# Altium schematic sheet Power Management.SchDoc
size A4; SheetNumber: 4; SheetTotal: 4
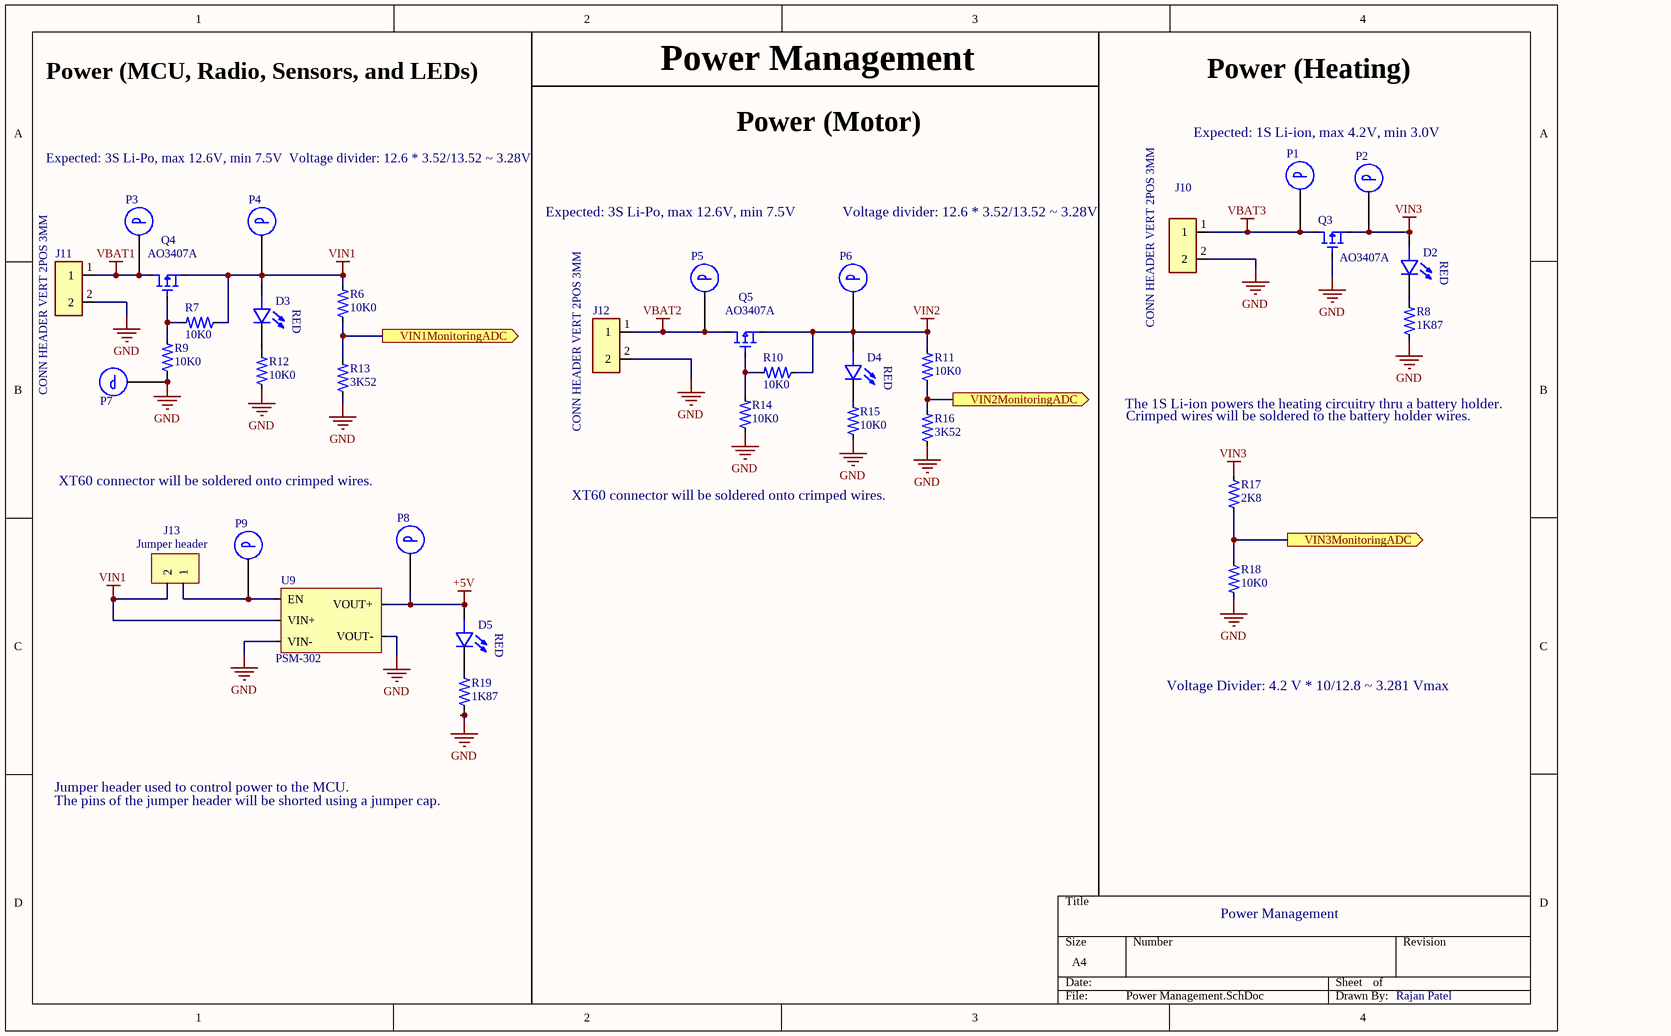
[diagram p0: Power Management.SchDoc]

## Parts
D2  LED 0805  [LED_0805]  (value not drawn)
D3  LED 0805  [LED_0805]  (value not drawn)
D4  LED 0805  [LED_0805]  (value not drawn)
D5  LED 0805  [LED_0805]  (value not drawn)
J10  CONN HEADER VERT 2POS 3MM  [CONN HEADER VERT 2POS 3MM]
J11  CONN HEADER VERT 2POS 3MM  [CONN HEADER VERT 2POS 3MM]
J12  CONN HEADER VERT 2POS 3MM  [CONN HEADER VERT 2POS 3MM]
J13  Jumper header  [2 Pin Male Header]
P1  Probe_5019  [Testpoint]  (value not drawn)
P2  Probe_5019  [Testpoint]  (value not drawn)
P3  Probe_5019  [Testpoint]  (value not drawn)
P4  Probe_5019  [Testpoint]  (value not drawn)
P5  Probe_5019  [Testpoint]  (value not drawn)
P6  Probe_5019  [Testpoint]  (value not drawn)
P7  Probe_5019  [Testpoint]  (value not drawn)
P8  Probe_5019  [Testpoint]  (value not drawn)
P9  Probe_5019  [Testpoint]  (value not drawn)
Q3  AO3407A  [AO3407A]
Q4  AO3407A  [AO3407A]
Q5  AO3407A  [AO3407A]
R6  10K0  [res 0805]
R7  10K0  [res 0805]
R8  1K87  [res 0805]
R9  10K0  [res 0805]
R10  10K0  [res 0805]
R11  10K0  [res 0805]
R12  10K0  [res 0805]
R13  3K52  [res 0805]
R14  10K0  [res 0805]
R15  10K0  [res 0805]
R16  3K52  [res 0805]
R17  2K8  [res 0805]
R18  10K0  [res 0805]
R19  1K87  [res 0805]
U9  PSM-302  [PSM-302]

## Ports
VIN1MonitoringADC (out, see MCU, Radios, and Sensors[3C]), VIN2MonitoringADC (out, see MCU, Radios, and Sensors[4C]), VIN3MonitoringADC (out, see MCU, Radios, and Sensors[3C])

## Nets
+5V: D5.2(A) P8.1 U9.5(VOUT+)
GND: J10.2 J11.2 J12.2 P7.1 Q3.1(Gate) R8.1 R9.1 R12.1 R13.1 R14.1 R15.1 R16.1 R18.2 R19.1 U9.3(VIN-) U9.4(VOUT-)
VBAT1: J11.1 P3.1 Q4.3(Drain)
VBAT2: J12.1 P5.1 Q5.3(Drain)
VBAT3: J10.1 P1.1 Q3.3(Drain)
VIN1: D3.2(A) J13.2 P4.1 Q4.2(Source) R6.2 R7.1 U9.2(VIN+)
VIN2: D4.2(A) P6.1 Q5.2(Source) R10.1 R11.2
VIN3: D2.2(A) P2.1 Q3.2(Source) R17.1
VIN1MonitoringADC: R6.1 R13.2 ; port VIN1MonitoringADC
VIN2MonitoringADC: R11.1 R16.2 ; port VIN2MonitoringADC
VIN3MonitoringADC: R17.2 R18.1 ; port VIN3MonitoringADC
NetD2_1: D2.1(C) R8.2
NetD3_1: D3.1(C) R12.2
NetD4_1: D4.1(C) R15.2
NetD5_1: D5.1(C) R19.2
NetJ13_1: J13.1 P9.1 U9.1(EN)
NetQ4_1: Q4.1(Gate) R7.2 R9.2
NetQ5_1: Q5.1(Gate) R10.2 R14.2

## Notes on the sheet
- Power (MCU, Radio, Sensors, and LEDs)
- Power Management
- Power (Heating)
- Expected: 3S Li-Po, max 12.6V, min 7.5V
- Voltage divider: 12.6 * 3.52/13.52 ~ 3.28V
- Power (Motor)
- Expected: 1S Li-ion, max 4.2V, min 3.0V
- The 1S Li-ion powers the heating circuitry thru a battery holder.
- Crimped wires will be soldered to the battery holder wires.
- XT60 connector will be soldered onto crimped wires.
- Voltage Divider: 4.2 V * 10/12.8 ~ 3.281 Vmax
- Jumper header used to control power to the MCU.
- The pins of the jumper header will be shorted using a jumper cap.
- Rajan Patel
- (in symbol LED 0805) RED

## Library data of the parts
D2-D5 = LED 0805: Red LED Indication - Discrete 1.7V 0805 (2012 Metric); MP: 7012X1; Package: None; Availability: Unavailable; Value: *; Price: None
J10-J12 = 0436500228: Rectangular Power Connector, 2 Contact(s), Female, Solder Terminal; Manufacturer Part Number: 43650-0228; Manufacturer Series: 43650; MF: Molex; MP: 0436500200; Connector Type: Power,Rectangular; Number of Contacts: 2; Option: General Purpose; Contact Style: SQ PIN-SKT; Durability: 30Cycles; Empty Shell: No; Mating Information: MULTIPLE MATING PARTS AVAILABLE; Number Of Connectors: 1; Rated Current (Signal): 5A; Board Mounting Option: PEG; Body/Shell Style: RECEPTACLE; Contact Resistance: 10mR; Dielectric Withstanding Voltage (AC): 1.5kV; Insertion Force-Max: 8.0064N; Insulation Resistance: 1GR; Polarization Key: POLARIZED HOUSING; Withdrawl Force-Min: 3.614N; Mating Contact Pitch: 0.118inch; Mounting Option 1: POLARIZED LCK; Mounting Option 2: LOCKING; Plating Thickness: 15uin; Body Breadth: 0.219inch; Body Depth: 0.39inch; Body Length: 0.38inch; Reference Standard: UL; Reliability: COMMERCIAL; SnapEDA_Link: https://www.snapeda.com/parts/0436500200/Molex/view-part/552556/?ref=snap; Price: None; Availability: Unavailable; Package: None; Value: *; Supplier: Mouser; Supplier Part Number: 538-43650-0228; Manufacturer: Molex; RoHS: Yes; Category: Headers and Wire Housings; Stock: 12783; Pricing: 1=0.78, 10=0.537, 50=0.537, 100=0.537, 1000=0.536, 10000=0.473 (USD); Mounting Technology: Board; Contact Finish - Mating: AU; Insulation Color: Black; Insulation Material: Polymer; Shell Material: Polymer; Contact Material: Brass; Contact Finish - Termination: TIN/LEAD OVER NICKEL; Min Operating Temperature: -40°C; Max Operating Temperature: 105°C; Contact Gender: Male; Termination: Solder; Contact Pattern: RECTANGULAR; Filter Feature: No; Mixed Contacts: No; Mounting Style: STRAIGHT; Number of Rows Loaded: 1; Number Of PCB Rows: 1; PCB Contact Pattern: RECTANGULAR; Terminal Length: 0.125inch; Terminal Pitch: 2.9972mm; Flammability Rating: UL94 V-0; Reach SVHC Compliant: Yes; RoHS Compliant: Yes; DIN Conformance: No; IEC Conformance: No; MIL Conformance: No; ComponentLink1URL: https://datasheet.ciiva.com:443/pdfs/VipMasterIC/IC/MOLE/MOLES07498/MOLES07498-1.pdf?src-supplier=IHS+Markit; ComponentLink1Description: https://datasheet.ciiva.com:443/pdfs/VipMasterIC/IC/MOLE/MOLES07498/MOLES07498-1.pdf?src-supplier=IHS+Markit; ComponentLink2URL: https://datasheet.ciiva.com/13550/0436500228-pcb-headers-148884-13550297.pdf?src-supplier=Mouser; ComponentLink2Description: https://datasheet.ciiva.com/13550/0436500228-pcb-headers-148884-13550297.pdf?src-supplier=Mouser
J13 = 2 Pin Male Header: Board Connector, 2 Contact(s), 1 Row(s), Male, Straight, 0.1 inch Pitch, Solder Terminal, Black Insulator, Receptacle; Manufacturer: TE Connectivity; Manufacturer Part Number: 5-146277-2; Option: General Purpose; Contact Pattern: RECTANGULAR; Contact Style: SQ PIN-SKT; Filter Feature: No; Number Of Connectors: 1; Number of Contacts: 2; Body Breadth: 0.092inch; Body Depth: 0.09inch; Body Length: 0.184inch; Plating Thickness: 30uin; Reference Standard: UL; Reliability: COMMERCIAL; Supplier: Digikey; Supplier Part Number: A121371-ND; RoHS: Yes; Category: Connectors; Stock: 17660; Pricing: 1=0.41, 10=0.372, 100=0.3099, 500=0.2634, 1000=0.23087, 5000=0.20608, 10000=0.19176 (USD); Mounting Technology: Board; Contact Finish - Mating: MATTE TIN; Contact Finish - Termination: MATTE TIN; Insulation Color: Black; Insulation Material: Polymer; Connector Type: BOARD CONNECTOR; JESD-609 Code: e3; Body/Shell Style: RECEPTACLE; Contact Gender: Male; Mixed Contacts: No; Mounting Style: STRAIGHT; Number Of PCB Rows: 1; Number of Rows Loaded: 1; PCB Contact Pattern: RECTANGULAR; Termination: Solder; Mating Contact Pitch: 0.1inch; Terminal Length: 0.125inch; Terminal Pitch: 2.54mm; DIN Conformance: No; IEC Conformance: No; MIL Conformance: No; Reach SVHC Compliant: Yes; RoHS Compliant: Yes; ComponentLink1URL: https://datasheet.ciiva.com:443/pdfs/VipMasterIC/IC/TYEL/TYEL-L-A0003497673/TYEL-S-A0000657051-1.pdf?src-supplier=IHS+Markit; ComponentLink1Description: https://datasheet.ciiva.com:443/pdfs/VipMasterIC/IC/TYEL/TYEL-L-A0003497673/TYEL-S-A0000657051-1.pdf?src-supplier=IHS+Markit; ComponentLink2URL: https://datasheet.ciiva.com/22660/1537112-22660377.pdf?src-supplier=Element14; ComponentLink2Description: https://datasheet.ciiva.com/22660/1537112-22660377.pdf?src-supplier=Element14; ComponentLink3URL: https://datasheet.ciiva.com/717/eng-cd-146277-h-146277-1-c-dwg-717333.pdf?src-supplier=Digikey; ComponentLink3Description: https://datasheet.ciiva.com/717/eng-cd-146277-h-146277-1-c-dwg-717333.pdf?src-supplier=Digikey; ComponentLink4URL: https://datasheet.ciiva.com/16426/eng-cd-146277-g2-16426389.pdf?src-supplier=Future+Electronics; ComponentLink4Description: https://datasheet.ciiva.com/16426/eng-cd-146277-g2-16426389.pdf?src-supplier=Future+Electronics; ComponentLink5URL: https://datasheet.ciiva.com/30096/146277-30096236.pdf?src-supplier=Onlinecomponents.com; ComponentLink5Description: https://datasheet.ciiva.com/30096/146277-30096236.pdf?src-supplier=Onlinecomponents.com
P1-P9 = Probe_5019: Phosphor Bronze Contact Miniature Silver Plated Surface Mount Test Points; Manufacturer: Keystone Electronics; Manufacturer Part Number: 5019; Supplier 1: Newark; RoHS: Yes; Category: Connectors; Stock 1: 148000; Pricing 1: 1=0.12300, 1000=0.12300, 2000=0.11700, 4000=0.11300, 6000=0.11000 (USD); Mount: Surface Mount,PCB; Number of Pins: 1; Contact Plating: Silver; Contact Material: Bronze; Material: Bronze; Plating: Silver; Body Material: Bronze; Packaging: Tape and Reel; Package Quantity: 1; Termination: SMD/SMT; Series: 5019; Height: 0.09inch; RoHS Compliant: Yes; Lead Free: Lead Free; Reach SVHC Compliant: Yes; ComponentLink1URL: https://datasheet.ciiva.com/16318/m60-2p61-16318395.pdf?src-supplier=Future+Electronics; ComponentLink1Description: https://datasheet.ciiva.com/16318/m60-2p61-16318395.pdf?src-supplier=Future+Electronics; ComponentLink2URL: https://datasheet.ciiva.com/16885/70182998-16885945.pdf?src-supplier=Allied+Electronics; ComponentLink2Description: https://datasheet.ciiva.com/16885/70182998-16885945.pdf?src-supplier=Allied+Electronics; ComponentLink3URL: https://datasheet.ciiva.com/14848/m60-2p61-14848437.pdf?src-supplier=Digi-Key; ComponentLink3Description: https://datasheet.ciiva.com/14848/m60-2p61-14848437.pdf?src-supplier=Digi-Key; ComponentLink4URL: https://datasheet.ciiva.com/14848/m60-2p61-14848438.pdf?src-supplier=Digi-Key; ComponentLink4Description: https://datasheet.ciiva.com/14848/m60-2p61-14848438.pdf?src-supplier=Digi-Key; ComponentLink5URL: https://datasheet.ciiva.com/14848/m60-2p61-14848439.pdf?src-supplier=Digi-Key; ComponentLink5Description: https://datasheet.ciiva.com/14848/m60-2p61-14848439.pdf?src-supplier=Digi-Key; Supplier Part Number 1: 06W4636
Q3-Q5 = AO3407A: Small Signal Field-Effect Transistor, 4.3A I(D), 30V, 1-Element, P-Channel, Silicon, Metal-oxide Semiconductor FET; Manufacturer: Alpha & Omega Semiconductor; Package Body Material: Plastic; Drain-source On Resistance-Max: 48mR; Feedback Cap-Max (Crss): 90pF; Number of Elements: 1; Operating Mode: ENHANCEMENT MODE; Power Dissipation-Max (Abs): 1.4W; Transistor Application: SWITCHING; Qualification Status: Not Qualified; Supplier: Digikey; Supplier Part Number: 785-1006-1-ND; Manufacturer Part Number: AO3407A; RoHS: Yes; Category: MOSFETs; Stock: 856157; Pricing: 1=0.31, 10=0.22, 100=0.1112, 500=0.09854, 1000=0.07668 (USD); Pins: 3; Package Shape: Rectangular; Terminal Finish: Tin; Transistor Element Material: SILICON; Max Operating Temperature: 150°C; JESD-609 Code: e3; Polarity/Channel Type: P-CHANNEL; Drain Current-Max (Abs) (ID): 4.3A; Drain Current-Max (ID): 4.3A; DS Breakdown Voltage-Min: 30V; FET Technology: METAL-OXIDE SEMICONDUCTOR; JESD-30 Code: R-PDSO-G3; Moisture Sensitivity Level: 1; Package Style: SMALL OUTLINEMeter; Surface Mount: Yes; Terminal Form: Gull Wing; Terminal Position: DUAL; RoHS Compliant: Yes; Reach SVHC Compliant: Yes; ComponentLink1URL: https://datasheet.ciiva.com:443/pdfs/VipMasterIC/IC/ALOM/ALOMS01464/ALOMS01464-1.pdf?src-supplier=IHS+Markit; ComponentLink1Description: https://datasheet.ciiva.com:443/pdfs/VipMasterIC/IC/ALOM/ALOMS01464/ALOMS01464-1.pdf?src-supplier=IHS+Markit; ComponentLink2URL: https://datasheet.ciiva.com/940/ao3407a-940745.pdf?src-supplier=Digikey; ComponentLink2Description: https://datasheet.ciiva.com/940/ao3407a-940745.pdf?src-supplier=Digikey; ComponentLink3URL: https://datasheet.ciiva.com/940/ao3407a-940747.pdf?src-supplier=Digikey; ComponentLink3Description: https://datasheet.ciiva.com/940/ao3407a-940747.pdf?src-supplier=Digikey; ComponentLink4URL: https://datasheet.ciiva.com/18057/getdatasheetpartid-64436-18057110.pdf?src-supplier=Verical; ComponentLink4Description: https://datasheet.ciiva.com/18057/getdatasheetpartid-64436-18057110.pdf?src-supplier=Verical
R6-R19 = Resistor 0805: MP: 2-2176053-2; Resistance: .39; Power_Rating: .25 W; MF: TE Connectivity; Tolerance: 1%; Package: 0805; Value: *; SnapEDA_Link: https://www.snapeda.com/parts/2-2176053-2/TE%20Connectivity/view-part/2214511/?ref=snap; Availability: Unavailable; Price: None; EU_RoHS_Compliance: Compliant with Exemptions
U9 = PSM-302: 3-15VDC to 5VDC Step Down Regulator/Converter Module @ 600mA